# EasyEDA schematic design.json
TITLE: Sheet_1; REV: 1.0; Date: 2024-04-22; Sheet: 1/1; Drawn By: karlklaffen; Company: Your Company
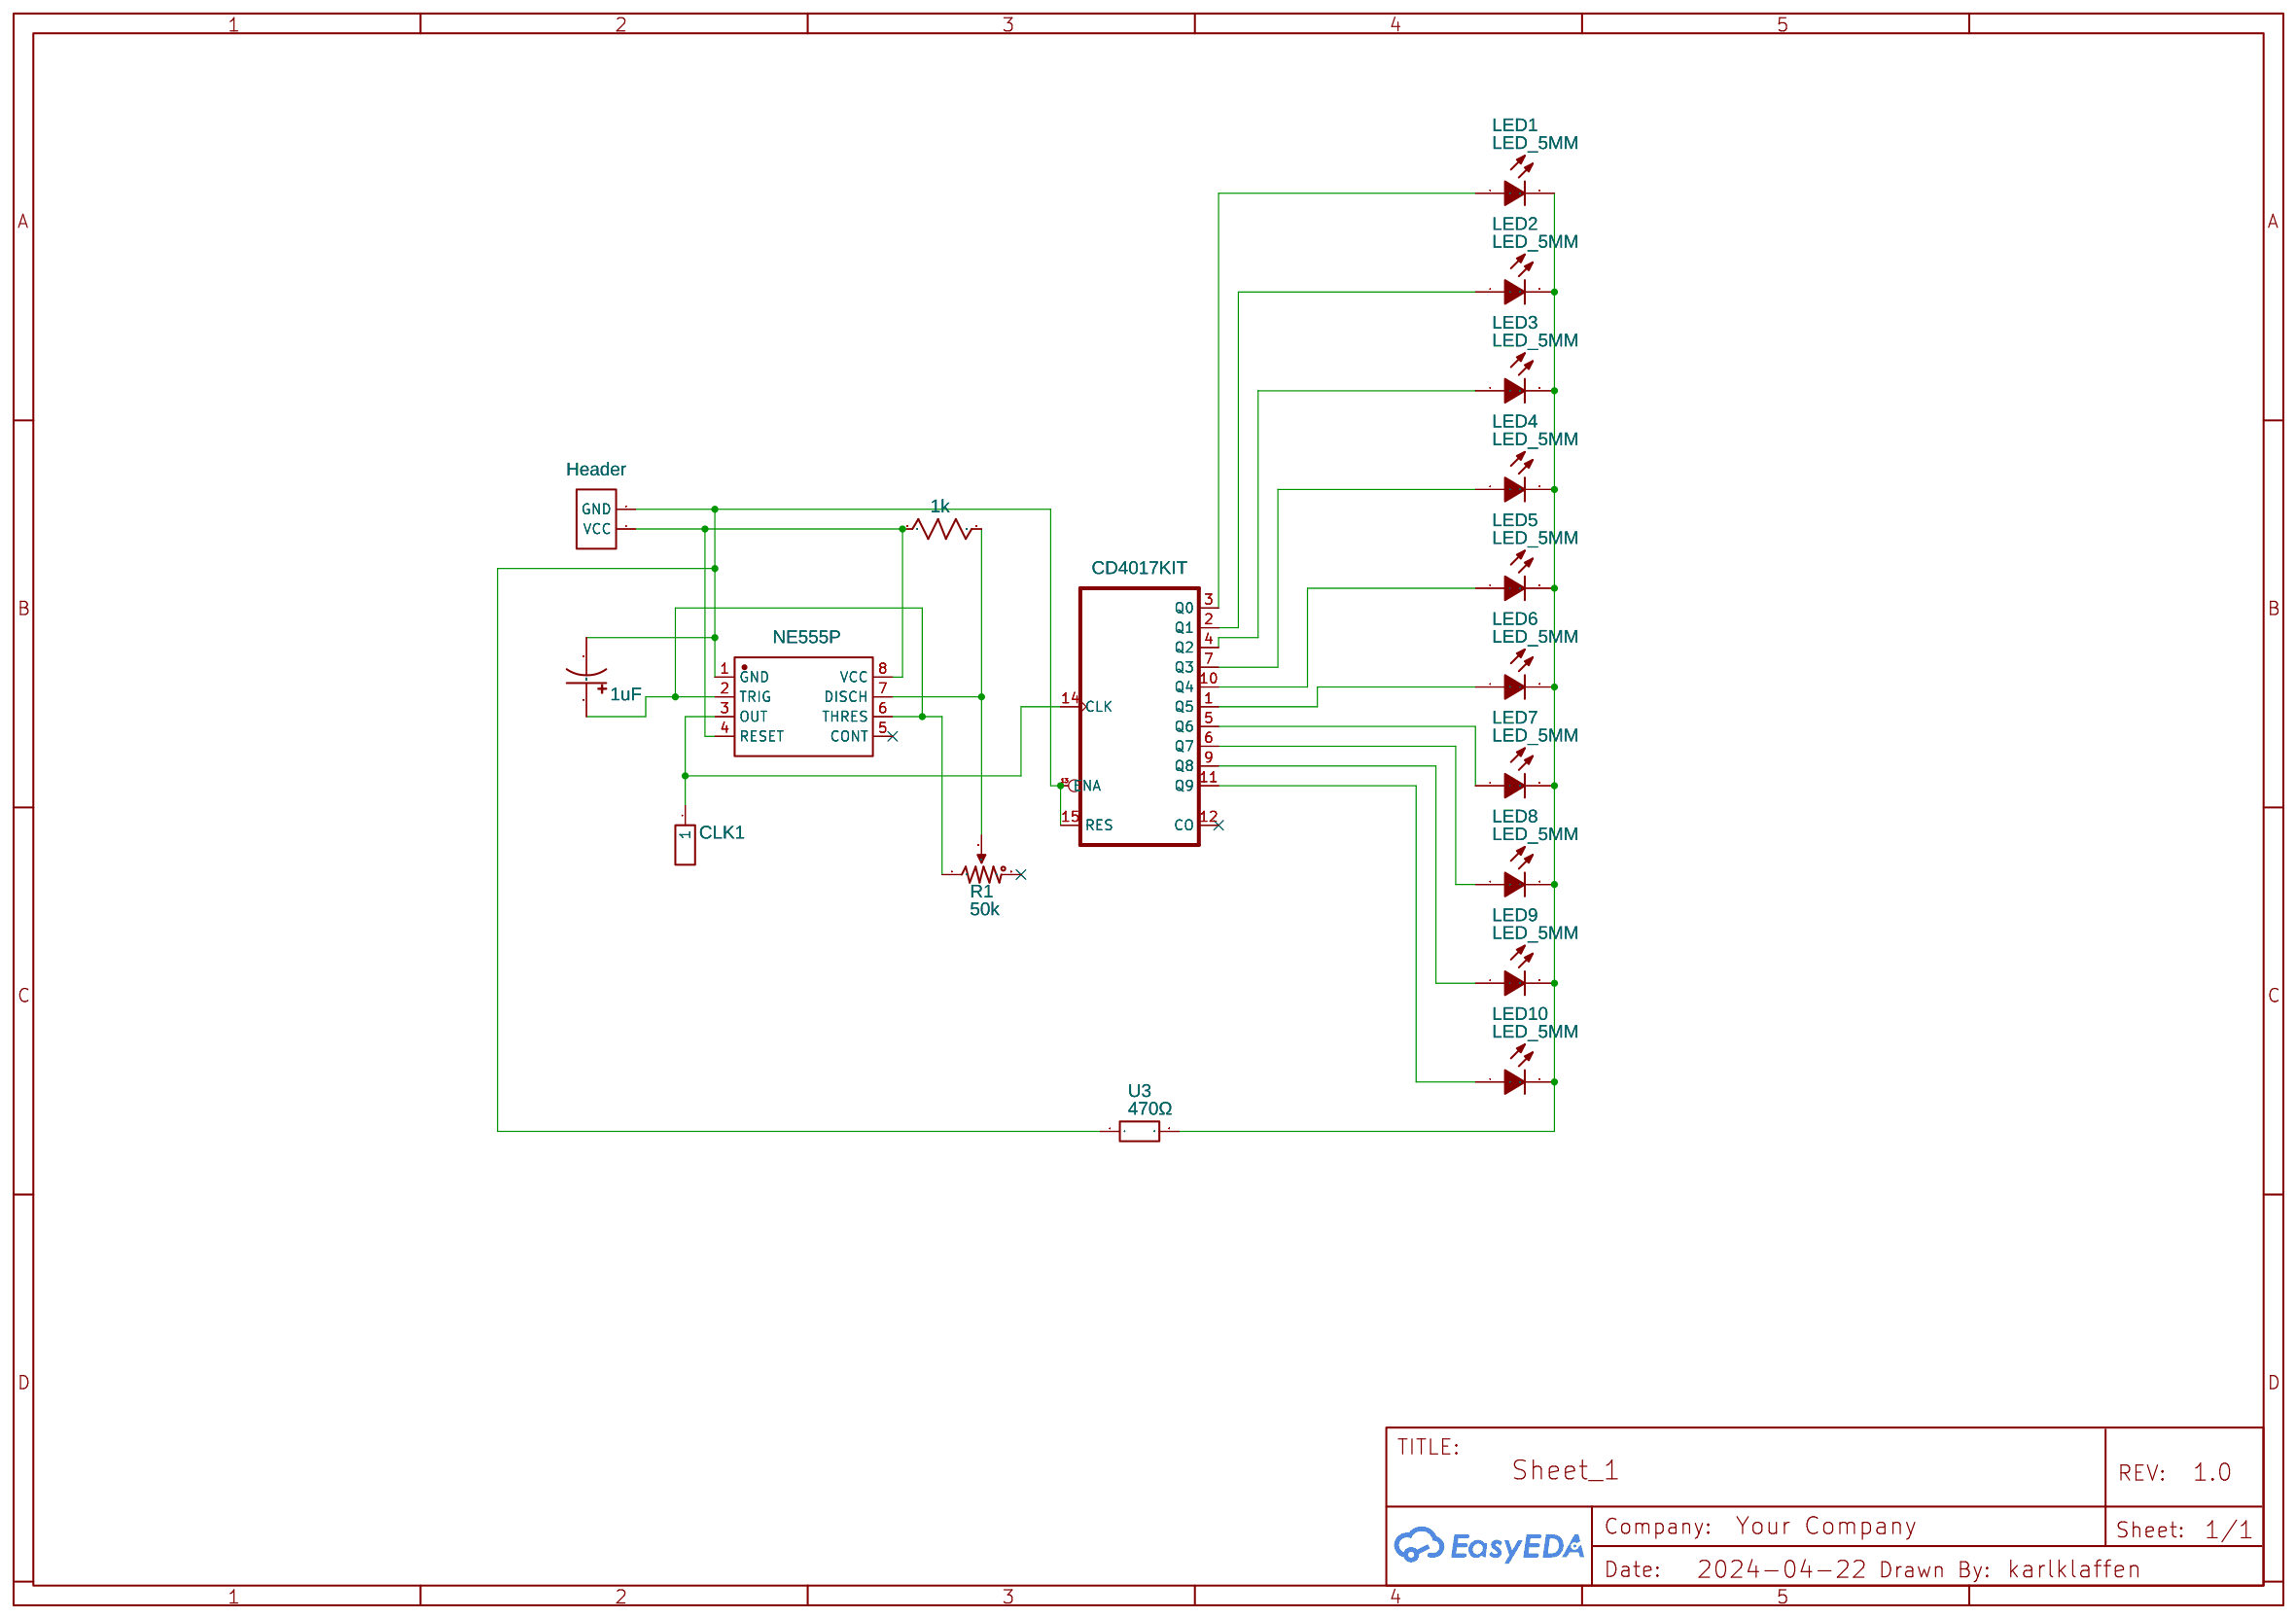
[diagram p0: schematic sheet]

## Parts
C2  1uF  [CAP-TH_BD5.0-P2.00-D0.8-FD]
CLK1  C81276  [HDR-TH_1P-P2.54-V-M]
H1  Header  [HEADER-FEMALE-2.54_1X2]
LED1  LED_5MM  [LED-TH_BD5.0-P2.54-FD_C9900023552]
LED2  LED_5MM  [LED-TH_BD5.0-P2.54-FD_C9900023552]
LED3  LED_5MM  [LED-TH_BD5.0-P2.54-FD_C9900023552]
LED4  LED_5MM  [LED-TH_BD5.0-P2.54-FD_C9900023552]
LED5  LED_5MM  [LED-TH_BD5.0-P2.54-FD_C9900023552]
LED6  LED_5MM  [LED-TH_BD5.0-P2.54-FD_C9900023552]
LED7  LED_5MM  [LED-TH_BD5.0-P2.54-FD_C9900023552]
LED8  LED_5MM  [LED-TH_BD5.0-P2.54-FD_C9900023552]
LED9  LED_5MM  [LED-TH_BD5.0-P2.54-FD_C9900023552]
LED10  LED_5MM  [LED-TH_BD5.0-P2.54-FD_C9900023552]
R1  50k  [RES-ADJ_3296X]
R3  1k  [AXIAL-0.3]
U1  NE555P  [DIP-8_L9.8-W6.6-P2.54-LS7.6-BL]
U3  470Ω  [RES-TH_BD3.3-L9.0-P13.00-D0.6]
U4  CD4017KIT  [DIP-16_L19.8-W6.7-P2.54-LS8.3-BL]  (section 1)

## Library data of the parts
C2 = UVZ1H010MDD: Contributor: LCSC; Supplier: LCSC; Supplier Part: C62934; Manufacturer: Nichicon(尼吉康)
CLK1 = Header-Male-2.54_1x1: Supplier: LCSC; Manufacturer Part: 2.54-1*1P针; JLCPCB Part Class: Extended Part; Package Display: No; Manufacturer: BOOMELE(Boom Precision Elec); Contributor: Thejo Prakash
H1 = HEADER-FEMALE-2.54_1X2: Contributor: nonstop2004; Supplier: LCSC; Supplier Part: C492401
LED1-LED10 = LED_5MM: Contributor: lcsc; Supplier: LCSC; Supplier Part: C2992663; Manufacturer: null; JLCPCB Part Class: Extended Part
R1 = Potentiometer: K(%): 50; Manufacturer Part: ?; Supplier: LCSC; Supplier Part: C118912
R3 = Resistor: Manufacturer Part: ?; Supplier Part: C713997; Supplier: LCSC
U1 = NE555P: Supplier: LCSC; Manufacturer: TI(德州仪器); Supplier Part: C46749; JLCPCB Part Class: Extended Part
U3 = RSF-50JT-52-470R: Contributor: lcsc; Supplier: LCSC; Supplier Part: C58592; Manufacturer: YAGEO(国巨)
U4 = CD4017KIT: Contributor: SparkFun; Supplier Part: C34519; Supplier: LCSC

## Nets
Net-(C2-1): C2.1 R1.1 U1.2(TRIG) U1.6(THRES)
Net-(C2-2): C2.2 H1.2(GND) U1.1(GND) U3.1 U4.13(ENA) U4.15(RES)
Net-(CLK1-1): CLK1.1 U1.3(OUT) U4.14(CLK)
Net-(H1-1): H1.1(VCC) R3.1 U1.4(RESET) U1.8(VCC)
Net-(LED1-1): LED1.1(A) U4.3(Q0)
Net-(LED1-2): LED1.2(K) LED2.2(K) LED3.2(K) LED4.2(K) LED5.2(K) LED6.2(K) LED7.2(K) LED8.2(K) LED9.2(K) LED10.2(K) U3.2
Net-(LED2-1): LED2.1(A) U4.2(Q1)
Net-(LED3-1): LED3.1(A) U4.4(Q2)
Net-(LED4-1): LED4.1(A) U4.7(Q3)
Net-(LED5-1): LED5.1(A) U4.10(Q4)
Net-(LED6-1): LED6.1(A) U4.1(Q5)
Net-(LED7-1): LED7.1(A) U4.5(Q6)
Net-(LED8-1): LED8.1(A) U4.6(Q7)
Net-(LED9-1): LED9.1(A) U4.9(Q8)
Net-(LED10-1): LED10.1(A) U4.11(Q9)
Net-(R1-2): R1.2(3) R3.2 U1.7(DISCH)

Not connected (* = marked no-connect by the designer): R1 3(2)*; U1 5(CONT)*; U4 12(CO)*
